# EasyEDA schematic SCH_EasyEDA.json
TITLE: Sheet_2; REV: 1.0; Date: 2026-03-18; Sheet: 1/1; Drawn By: angeleesme; Company: Your Company
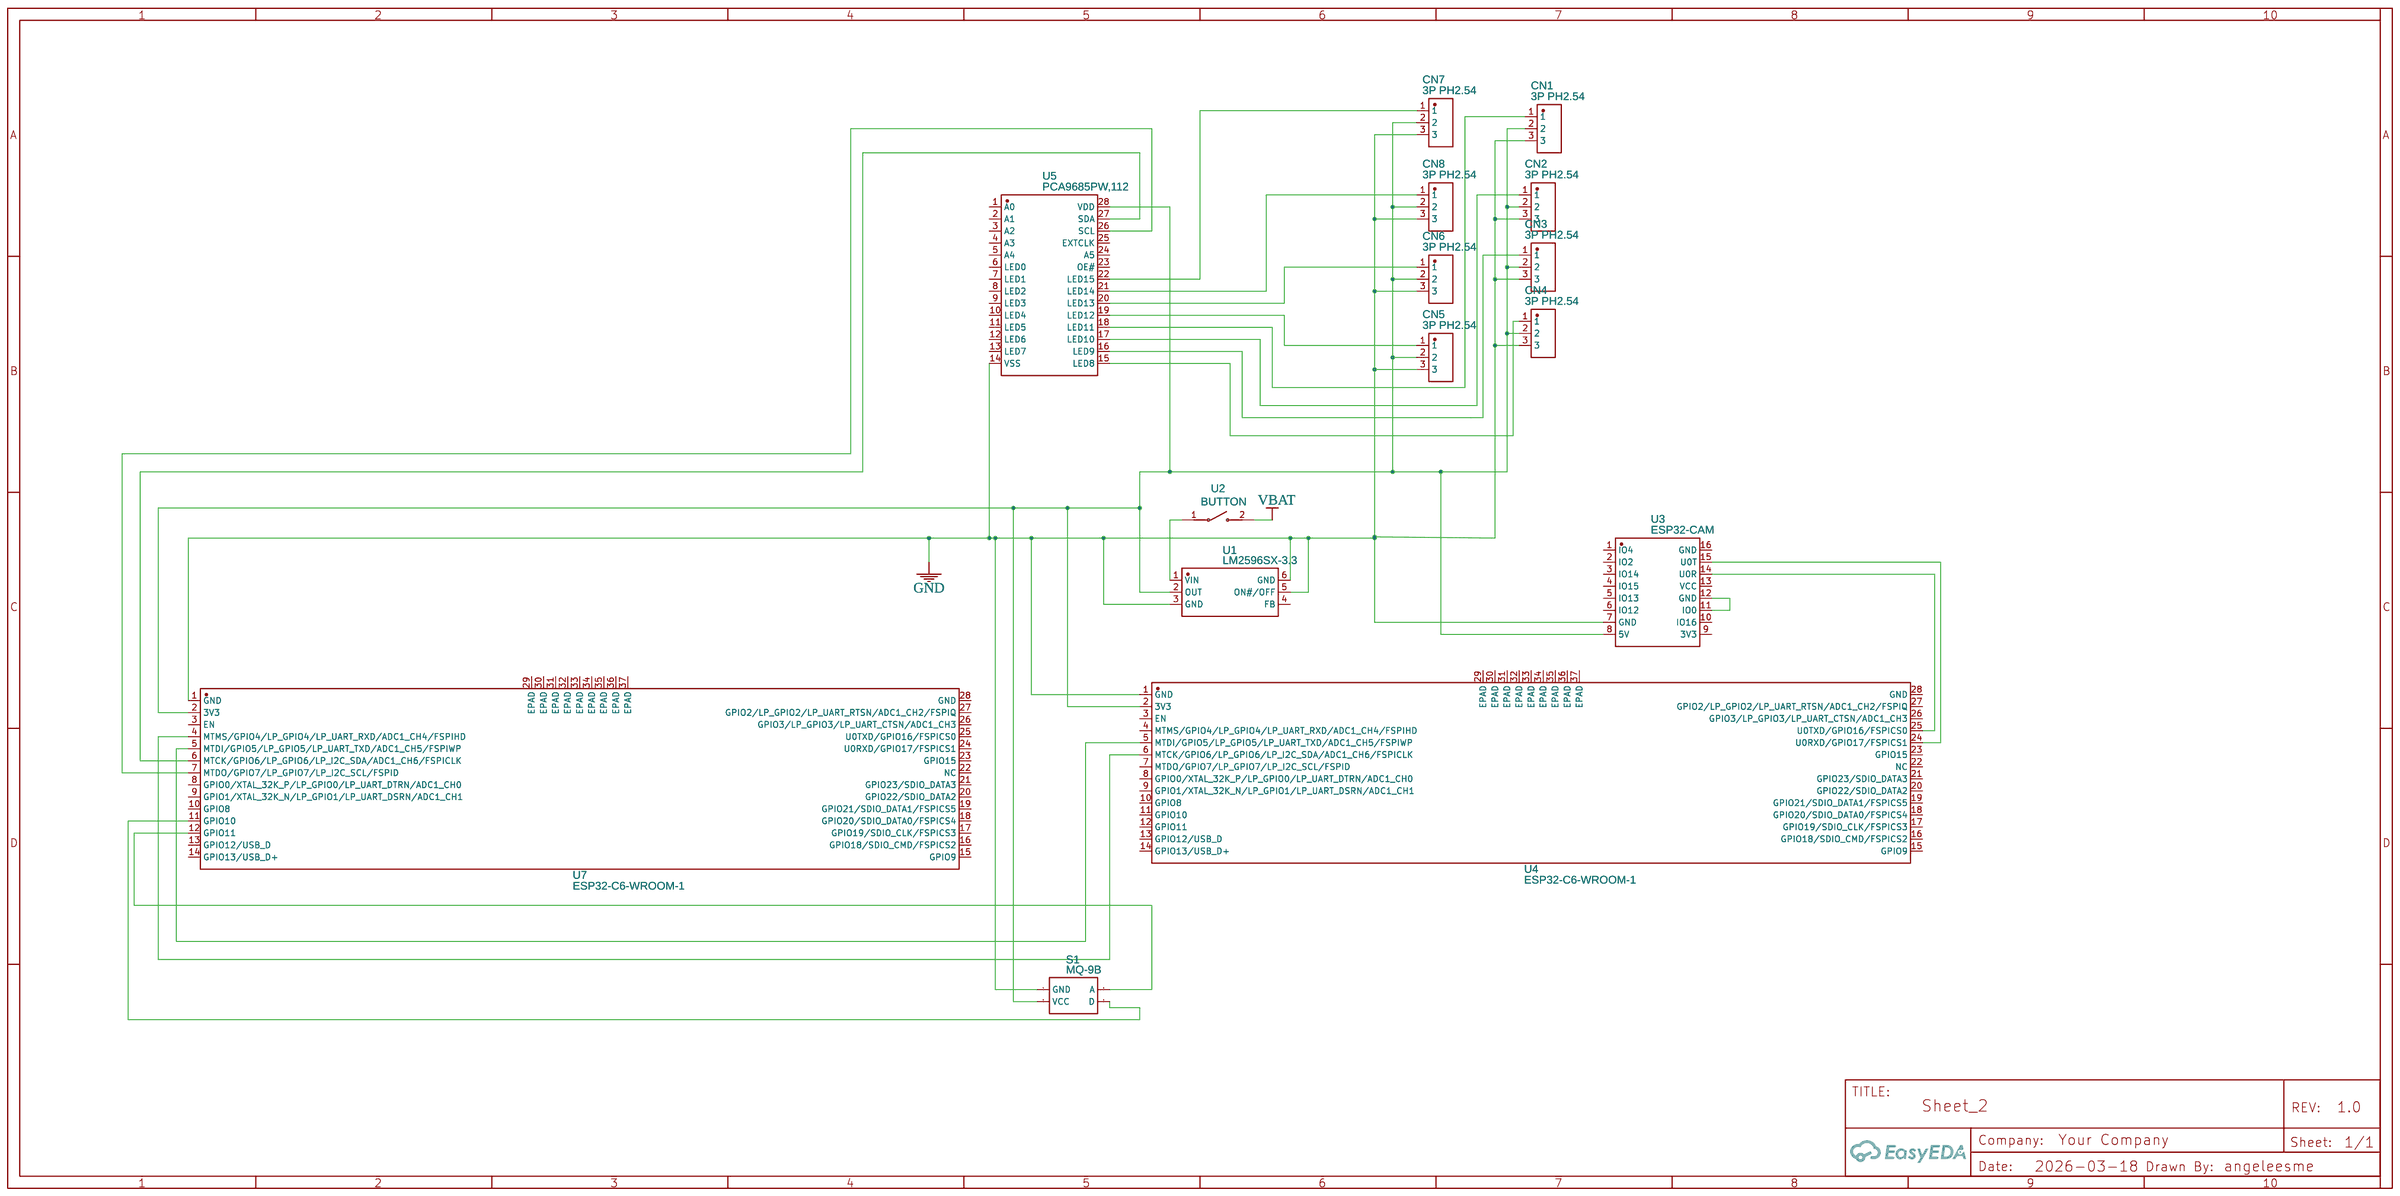
[diagram p0: schematic sheet]

## Parts
CN1  3P PH2.54  [CONN-TH_3P-P2.50_3PIN]
CN2  3P PH2.54  [CONN-TH_3P-P2.50_3PIN]
CN3  3P PH2.54  [CONN-TH_3P-P2.50_3PIN]
CN4  3P PH2.54  [CONN-TH_3P-P2.50_3PIN]
CN5  3P PH2.54  [CONN-TH_3P-P2.50_3PIN]
CN6  3P PH2.54  [CONN-TH_3P-P2.50_3PIN]
CN7  3P PH2.54  [CONN-TH_3P-P2.50_3PIN]
CN8  3P PH2.54  [CONN-TH_3P-P2.50_3PIN]
S1  MQ-9B  [HDR-F-2.54_2X2]
U1  LM2596SX-3.3  [TO-263-5_L10.2-W8.6-P1.70-LS14.4-TL]
U2  BUTTON  [SW-SMD_L3.9-W2.9-LS4.9-L]
U3  ESP32-CAM  [COMM-TH_16P-L40.0-W27.0-P2.54_ESP32-CAM]
U4  ESP32-C6-WROOM-1  [WIRELM-SMD_ESP32-C6-WROOM-1]
U5  PCA9685PW,112  [TSSOP-28_L9.7-W4.4-P0.65-LS6.4-BL]
U7  ESP32-C6-WROOM-1  [WIRELM-SMD_ESP32-C6-WROOM-1]

## Library data of the parts
CN1-CN8 = 3P PH2.54: Contributor: LCSC; Supplier: LCSC; Supplier Part: C9900006188; JLCPCB Part Class: Extended Part
S1 = HDR-F-2.54_2x2: Supplier Part: C239342; Supplier: LCSC; Contributor: LCEDA_Lib
U1 = LM2596SX-3.3: Contributor: lcsc; Supplier: LCSC; Supplier Part: C5186052; Manufacturer: Slkor(萨科微); JLCPCB Part Class: Extended Part
U2 = BUTTON: Contributor: lcsc; Supplier: LCSC; Supplier Part: C9900015607; Manufacturer: null; JLCPCB Part Class: Extended Part
U3 = ESP32-CAM: Supplier: LCSC; Supplier Part: C277946; Manufacturer: Ai-Thinker(安信可); JLCPCB Part Class: Extended Part; Contributor: lcsc
U4 U7 = ESP32-C6-WROOM-1: Contributor: lcsc; Supplier: LCSC; Supplier Part: C9900042482; Manufacturer: null
U5 = PCA9685PW,112: Contributor: lcsc; Supplier: LCSC; Supplier Part: C2688894; Manufacturer: NXP(恩智浦); JLCPCB Part Class: Extended Part

## Nets
GND: CN1.3 CN2.3 CN3.3 CN4.3 CN5.3 CN6.3 CN7.3 CN8.3 S1.1(GND) U1.3(GND) U1.5(ON#/OFF) U1.6(GND) U3.7(GND) U4.1(GND) U5.14(VSS) U7.1(GND)
VBAT: U2.2
Net-(CN1-1): CN1.1 U5.18(LED11)
Net-(CN1-2): CN1.2 CN2.2 CN3.2 CN4.2 CN5.2 CN6.2 CN7.2 CN8.2 S1.3(VCC) U1.2(OUT) U3.8(5V) U4.2(3V3) U5.28(VDD) U7.2(3V3)
Net-(CN2-1): CN2.1 U5.17(LED10)
Net-(CN3-1): CN3.1 U5.16(LED9)
Net-(CN4-1): CN4.1 U5.15(LED8)
Net-(CN5-1): CN5.1 U5.19(LED12)
Net-(CN6-1): CN6.1 U5.20(LED13)
Net-(CN7-1): CN7.1 U5.22(LED15)
Net-(CN8-1): CN8.1 U5.21(LED14)
Net-(S1-2): S1.2(A) U7.12(GPIO11)
Net-(S1-4): S1.4(D) U7.11(GPIO10)
Net-(U1-1): U1.1(VIN) U2.1
Net-(U3-11): U3.11(IO0) U3.12(GND)
Net-(U3-14): U3.14(U0R) U4.25(U0TXD/GPIO16/FSPICS0)
Net-(U3-15): U3.15(U0T) U4.24(U0RXD/GPIO17/FSPICS1)
Net-(U4-5): U4.5(MTDI/GPIO5/LP_GPIO5/LP_UART_TXD/ADC1_CH5/FSPIWP) U7.5(MTDI/GPIO5/LP_GPIO5/LP_UART_TXD/ADC1_CH5/FSPIWP)
Net-(U4-6): U4.6(MTCK/GPIO6/LP_GPIO6/LP_I2C_SDA/ADC1_CH6/FSPICLK) U7.4(MTMS/GPIO4/LP_GPIO4/LP_UART_RXD/ADC1_CH4/FSPIHD)
Net-(U5-26): U5.26(SCL) U7.7(MTDO/GPIO7/LP_GPIO7/LP_I2C_SCL/FSPID)
Net-(U5-27): U5.27(SDA) U7.6(MTCK/GPIO6/LP_GPIO6/LP_I2C_SDA/ADC1_CH6/FSPICLK)

Not connected (* = marked no-connect by the designer): U1 4(FB); U3 1(IO4) 2(IO2) 3(IO14) 4(IO15) 5(IO13) 6(IO12) 9(3V3) 10(IO16) 13(VCC) 16(GND); U4 3(EN) 4(MTMS/GPIO4/LP_GPIO4/LP_UART_RXD/ADC1_CH4/FSPIHD) 7(MTDO/GPIO7/LP_GPIO7/LP_I2C_SCL/FSPID) 8(GPIO0/XTAL_32K_P/LP_GPIO0/LP_UART_DTRN/ADC1_CH0) 9(GPIO1/XTAL_32K_N/LP_GPIO1/LP_UART_DSRN/ADC1_CH1) 10(GPIO8) 11(GPIO10) 12(GPIO11) 13(GPIO12/USB_D) 14(GPIO13/USB_D+) 15(GPIO9) 16(GPIO18/SDIO_CMD/FSPICS2) 17(GPIO19/SDIO_CLK/FSPICS3) 18(GPIO20/SDIO_DATA0/FSPICS4) 19(GPIO21/SDIO_DATA1/FSPICS5) 20(GPIO22/SDIO_DATA2) 21(GPIO23/SDIO_DATA3) 22(NC) 23(GPIO15) 26(GPIO3/LP_GPIO3/LP_UART_CTSN/ADC1_CH3) 27(GPIO2/LP_GPIO2/LP_UART_RTSN/ADC1_CH2/FSPIQ) 28(GND) 29(EPAD) 30(EPAD) 31(EPAD) 32(EPAD) 33(EPAD) 34(EPAD) 35(EPAD) 36(EPAD) 37(EPAD); U5 1(A0) 2(A1) 3(A2) 4(A3) 5(A4) 6(LED0) 7(LED1) 8(LED2) 9(LED3) 10(LED4) 11(LED5) 12(LED6) 13(LED7) 23(OE#) 24(A5) 25(EXTCLK); U7 3(EN) 8(GPIO0/XTAL_32K_P/LP_GPIO0/LP_UART_DTRN/ADC1_CH0) 9(GPIO1/XTAL_32K_N/LP_GPIO1/LP_UART_DSRN/ADC1_CH1) 10(GPIO8) 13(GPIO12/USB_D) 14(GPIO13/USB_D+) 15(GPIO9) 16(GPIO18/SDIO_CMD/FSPICS2) 17(GPIO19/SDIO_CLK/FSPICS3) 18(GPIO20/SDIO_DATA0/FSPICS4) 19(GPIO21/SDIO_DATA1/FSPICS5) 20(GPIO22/SDIO_DATA2) 21(GPIO23/SDIO_DATA3) 22(NC) 23(GPIO15) 24(U0RXD/GPIO17/FSPICS1) 25(U0TXD/GPIO16/FSPICS0) 26(GPIO3/LP_GPIO3/LP_UART_CTSN/ADC1_CH3) 27(GPIO2/LP_GPIO2/LP_UART_RTSN/ADC1_CH2/FSPIQ) 28(GND) 29(EPAD) 30(EPAD) 31(EPAD) 32(EPAD) 33(EPAD) 34(EPAD) 35(EPAD) 36(EPAD) 37(EPAD)
